# EAGLE design AugmentedStethoscope_v4 (EAGLE 8.6.3)
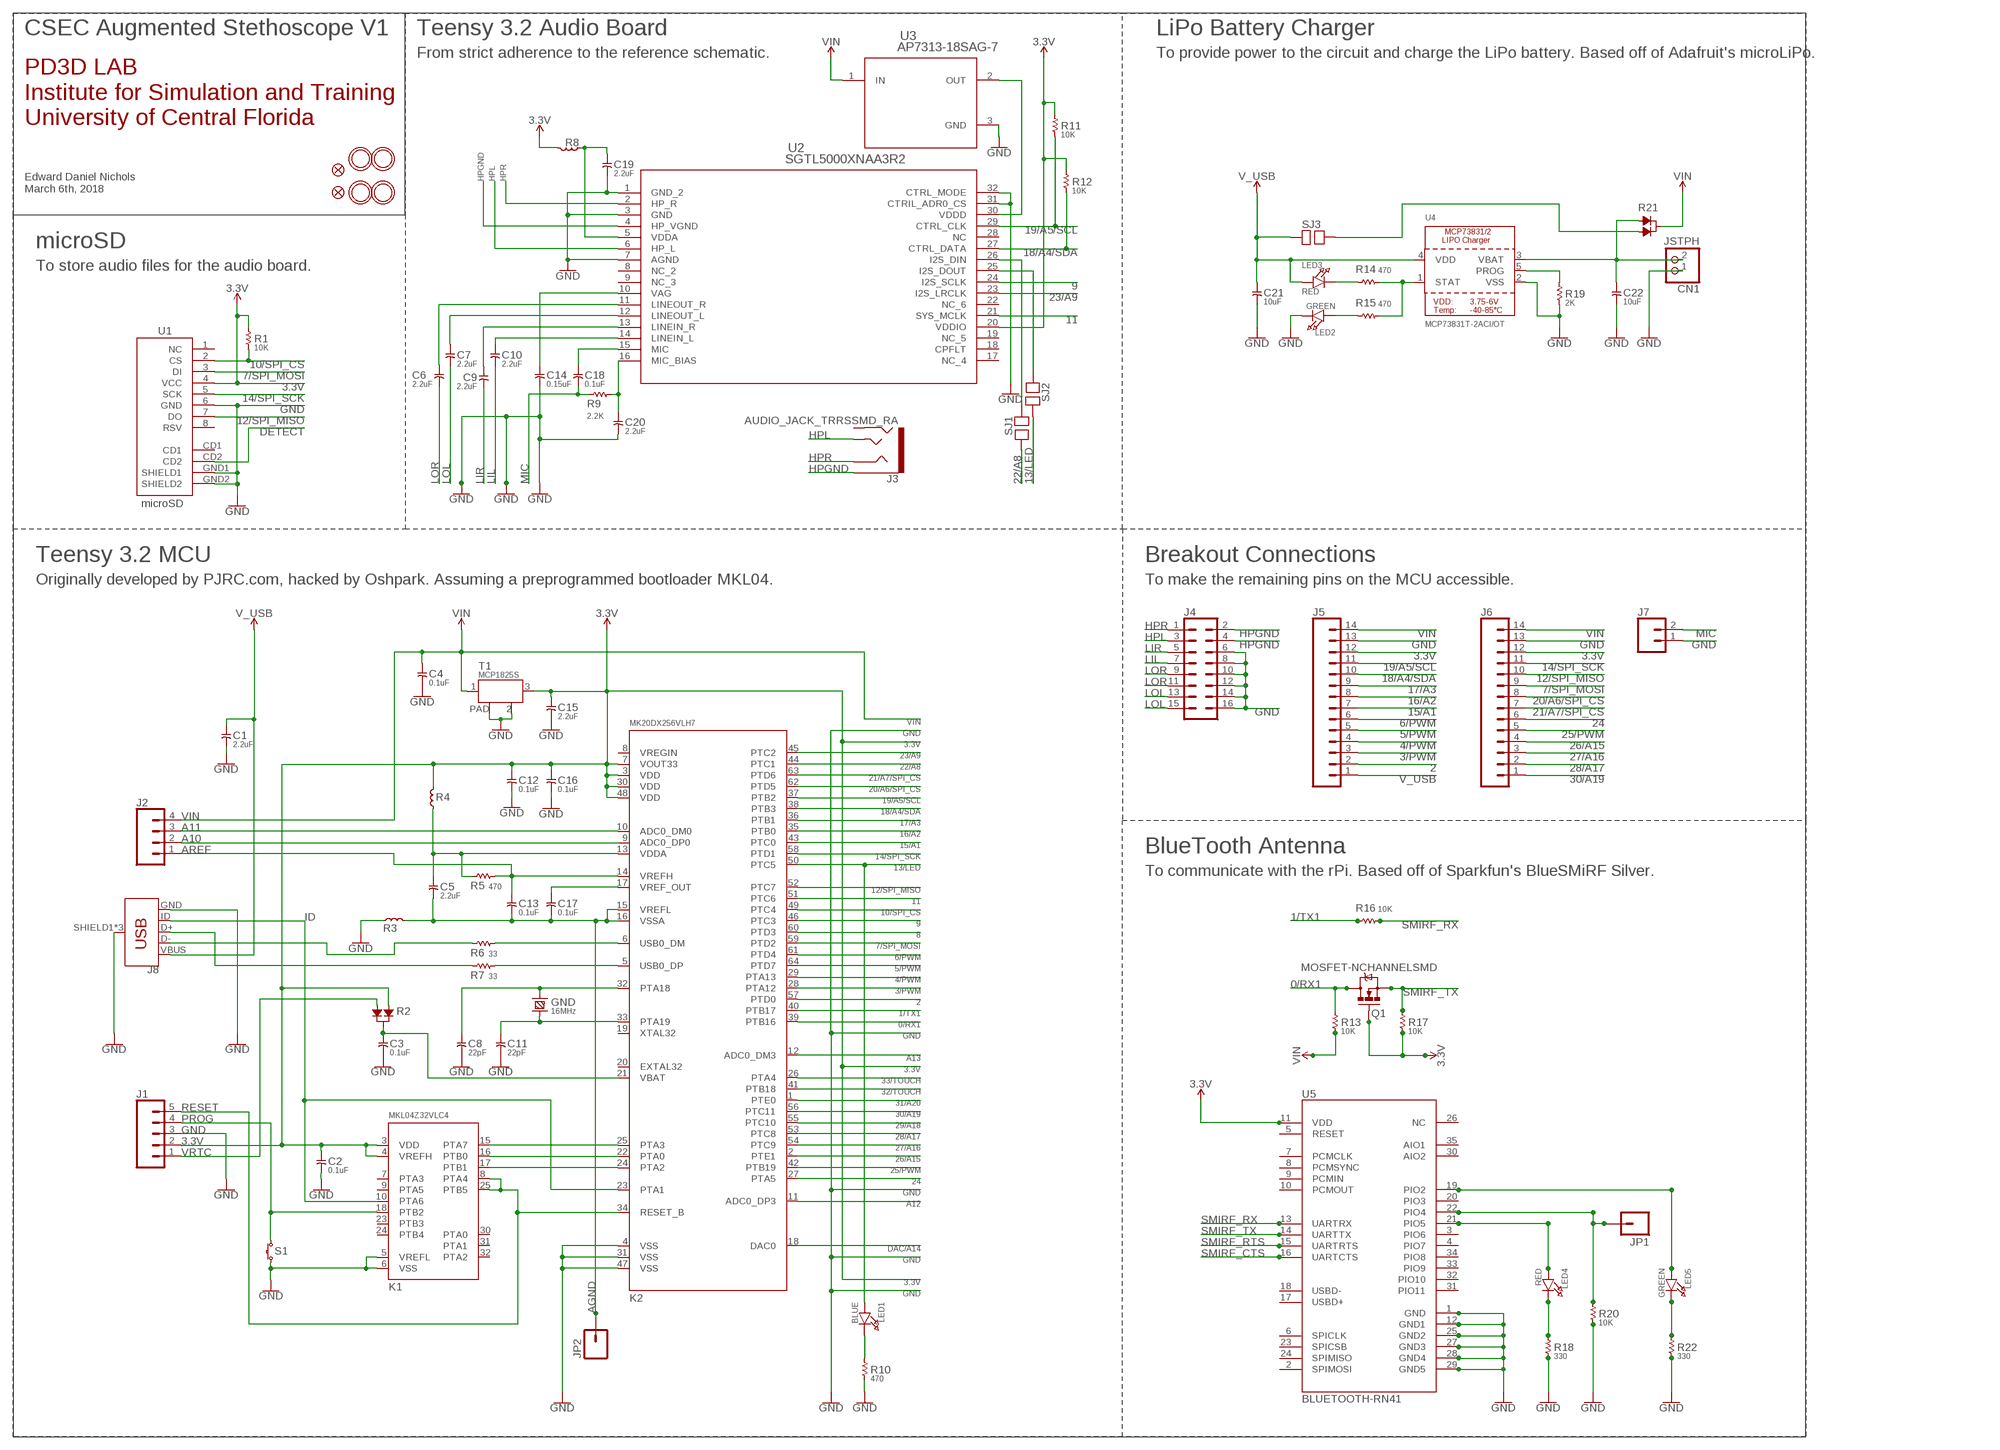
[diagram p0: schematic, sheet 1]

## Parts
C1  2.2uF  CAPACITOR-2.2UF  [C0805]
C2  0.1uF  CAPACITOR-0.1UF  [C0603]
C3  0.1uF  CAPACITOR-0.1UF  [C0603]
C4  0.1uF  CAPACITOR-0.1UF  [C0603]
C5  2.2uF  CAPACITOR-2.2UF  [C0805]
C6  2.2uF  CAPACITOR-2.2UF  [C0805]
C7  2.2uF  CAPACITOR-2.2UF  [C0805]
C8  22pF  CAPACITOR-22PF  [C0603]
C9  2.2uF  CAPACITOR-2.2UF  [C0805]
C10  2.2uF  CAPACITOR-2.2UF  [C0805]
C11  22pF  CAPACITOR-22PF  [C0603]
C12  0.1uF  CAPACITOR-0.1UF  [C0603]
C13  0.1uF  CAPACITOR-0.1UF  [C0603]
C14  0.15uF  CAPACITOR-2.2UF  [C0805]
C15  2.2uF  CAPACITOR-2.2UF  [C0805]
C16  0.1uF  CAPACITOR-0.1UF  [C0603]
C17  0.1uF  CAPACITOR-0.1UF  [C0603]
C18  0.1uF  CAPACITOR-2.2UF  [C0805]
C19  2.2uF  CAPACITOR-2.2UF  [C0805]
C20  2.2uF  CAPACITOR-2.2UF  [C0805]
C21  10uF  CAPACITOR-0.1UF  [C0603]
C22  10uF  CAPACITOR-0.1UF  [C0603]
CN1  JSTPH  JST_2PIN  [JSTPH2]
FID2  FIDUCIAL""  [FIDUCIAL_1MM]
FID3  FIDUCIAL""  [FIDUCIAL_1MM]
GND  16MHz  CRYSTAL-HC49US  [HC49US]
J1  CONN_05  [1X05]
J2  CONN_04  [1X04]
J3  AUDIO_JACK_TRRSSMD_RA  [AUDIO_JACK_3.5MM_TRRS_SMD_RA]
J4  CONN_08X2  [2X8]
J5  CONN_14  [1X14]
J6  CONN_14  [1X14]
J7  CONN_02  [1X02]
J8  USB_MICRO-B_FEMALE-SMT  [USB-B-MICRO-SMD]
JP1  M01SMDNS  [1X01NS]
JP2  M01SMDNS  [1X01NS]
K1  MKL04Z32VLC4  [LQFP32-08]
K2  MK20DX256VLH7  [LQFP64-05]
LED1  BLUE  LED0805  [CHIPLED_0805]
LED2  GREEN  LED0805  [CHIPLED_0805]
LED3  RED  LED0805  [CHIPLED_0805]
LED4  RED  LED0805  [CHIPLED_0805]
LED5  GREEN  LED0805  [CHIPLED_0805]
Q1  MOSFET-NCHANNELSMD  [SOT23-3]
R1  10K  RESISTOR-470R  [R0603]
R2  DIODE_DUAL  [SOT-23]
R3  FERRITE  [L0603]
R4  FERRITE  [L0603]
R5  470  RESISTOR-470R  [R0603]
R6  33  RESISTOR-33R  [R0603]
R7  33  RESISTOR-33R  [R0603]
R8  FERRITE  [L0603]
R9  2.2K  RESISTOR-470R  [R0603]
R10  470  RESISTOR-470R  [R0603]
R11  10K  RESISTOR-470R  [R0603]
R12  10K  RESISTOR-470R  [R0603]
R13  10K  RESISTOR-470R  [R0603]
R14  470  RESISTOR-33R  [R0603]
R15  470  RESISTOR-33R  [R0603]
R16  10K  RESISTOR-33R  [R0603]
R17  10K  RESISTOR-470R  [R0603]
R18  330  RESISTOR-470R  [R0603]
R19  2K  RESISTOR-470R  [R0603]
R20  10K  RESISTOR-470R  [R0603]
R21  DIODE_DUAL  [SOT-23]
R22  330  RESISTOR-470R  [R0603]
S1  TACT_SWITCH  [ALPS_SKHH]
SJ1  SOLDERJUMPER  [SOLDERJUMPER]
SJ2  SOLDERJUMPER  [SOLDERJUMPER]
SJ3  SOLDERJUMPER  [SOLDERJUMPER]
T1  MCP1825S  LDO  [SOT-223]
U1  microSD  USD-SOCKETSMD  [MICRO-SD-SOCKET-PP]
U2  SGTL5000XNAA3R2  [QFN32]
U3  AP7313-18SAG-7  [SOT-23]
U4  MCP73831T-2ACI/OT  MCP73831/2  [SOT23-5]
U5  BLUETOOTH-RN41  BLUETOOTH-RN41"  [RN41]
U$1  MOUNTINGHOLE2.5  [MOUNTINGHOLE_2.5_PLATED]
U$15  MOUNTINGHOLE2.5  [MOUNTINGHOLE_2.5_PLATED]
U$17  MOUNTINGHOLE2.5  [MOUNTINGHOLE_2.5_PLATED]
U$18  MOUNTINGHOLE2.5  [MOUNTINGHOLE_2.5_PLATED]

## Nets
0/RX1: K2.39(PTB16) Q1.3(D) R13.2
1/TX1: K2.40(PTB17) R16.1
2: J5.2 K2.57(PTD0)
3.3V [power]: C2.1 C12.1 C15.1 C16.1 J1.2 J5.12 J6.12 K1.3(VDD) K1.4(VREFH) K2.3(VDD) K2.7(VOUT33) K2.30(VDD) K2.48(VDD) Q1.1(G) R1.2 R2.1 R4.2 R8.2 R11.2 R12.2 R17.1 T1.3(OUT) U1.4(VCC) U2.20(VDDIO) U5.11(VDD)
3/PWM: J5.3 K2.28(PTA12)
4/PWM: J5.4 K2.29(PTA13)
5/PWM: J5.5 K2.64(PTD7)
6/PWM: J5.6 K2.61(PTD4)
7/SPI_MOSI: J6.9 K2.59(PTD2) U1.3(DI)
8: K2.60(PTD3)
9: K2.46(PTC3) U2.24(I2S_SCLK)
10/SPI_CS: K2.49(PTC4) R1.1 U1.2(CS)
11: K2.51(PTC6) U2.21(SYS_MCLK)
12/SPI_MISO: J6.10 K2.52(PTC7) U1.7(DO)
13/LED: K2.50(PTC5) LED1.A SJ2.2
14/SPI_SCK: J6.11 K2.58(PTD1) U1.5(SCK)
15/A1: J5.7 K2.43(PTC0)
16/A2: J5.8 K2.35(PTB0)
17/A3: J5.9 K2.36(PTB1)
18/A4/SDA: J5.10 K2.38(PTB3) R12.1 U2.27(CTRL_DATA)
19/A5/SCL: J5.11 K2.37(PTB2) R11.1 U2.29(CTRL_CLK)
20/A6/SPI_CS: J6.8 K2.62(PTD5)
21/A7/SPI_CS: J6.7 K2.63(PTD6)
22/A8: K2.44(PTC1) SJ1.2
23/A9: K2.45(PTC2) U2.23(I2S_LRCLK)
24: J6.6 K2.27(PTA5)
25/PWM: J6.5 K2.42(PTB19)
26/A15: J6.4 K2.2(PTE1)
27/A16: J6.3 K2.54(PTC9)
28/A17: J6.2 K2.53(PTC8)
29/A18: K2.55(PTC10)
30/A19: J6.1 K2.56(PTC11)
31/A20: K2.1(PTE0)
32/TOUCH: K2.41(PTB18)
33/TOUCH: K2.26(PTA4)
A10: J2.2 K2.9(ADC0_DP0)
A11: J2.3 K2.10(ADC0_DM0)
A12: K2.11(ADC0_DP3)
A13: K2.12(ADC0_DM3)
AGND: C5.2 C13.2 C17.2 JP2.1 K2.15(VREFL) K2.16(VSSA) R3.2
AREF: C13.1 J2.1 K2.14(VREFH) R5.2
D3: LED4.C R18.2
D4: LED5.C R22.2
D+: J8.D+ R7.1
D-: J8.D- R6.1
DAC/A14: K2.18(DAC0)
DETECT: U1.CD2
GND [power]: C1.2 C2.2 C3.2 C4.2 C8.2 C11.2 C12.2 C14.2 C15.2 C16.2 C19.2 C20.2 C21.2 C22.2 CN1.1 J1.3 J4.6 J4.8 J4.10 J4.12 J4.14 J4.16 J5.13 J6.13 J7.1 J8.GND J8.SHIELD1(SHIELD) J8.SHIELD2(SHIELD) J8.SHIELD3(SHIELD) K1.5(VREFL) K1.6(VSS) K2.4(VSS) K2.31(VSS) K2.47(VSS) LED2.C R3.1 R10.1 R18.1 R19.1 R20.1 R22.1 S1.3 S1.4 T1.2(GND) T1.PAD U1.6(GND) U1.GND1(SHIELD1) U1.GND2(SHIELD2) U2.1(GND_2) U2.3(GND) U2.7(AGND) U2.31(CTRIL_ADR0_CS) U2.32(CTRL_MODE) U3.3(GND) U4.2(VSS) U5.1(GND) U5.12(GND1) U5.25(GND2) U5.27(GND3) U5.28(GND4) U5.29(GND5)
HPGND: J3.EARTH J4.2 J4.4 U2.4(HP_VGND)
HPL: J3.TIP J4.3 U2.6(HP_L)
HPR: J3.RING1 J4.1 U2.2(HP_R)
ID: J8.ID K1.10(PTA6) K2.23(PTA1)
LIL: C10.2 J4.7
LIL_ISO: C10.1 U2.14(LINEIN_L)
LIR: C9.2 J4.5
LIR_ISO: C9.1 U2.13(LINEIN_R)
LOL: C7.2 J4.13 J4.15
LOL_ISO: C7.1 U2.12(LINEOUT_L)
LOR: C6.2 J4.9 J4.11
LOR_ISO: C6.1 U2.11(LINEOUT_R)
MIC: C18.2 J7.2 R9.1
MIC_BIAS: C20.1 R9.2 U2.16(MIC_BIAS)
N$1: C22.1 CN1.2 R21.1 U4.3(VBAT)
N$2: K1.16(PTB0) K2.22(PTA0)
N$3: K1.17(PTB1) K2.24(PTA2)
N$4: C14.1 U2.10(VAG)
N$5: C8.1 GND.1 K2.32(PTA18)
N$6: C11.1 GND.2 K2.33(PTA19)
N$9: SJ1.1 U2.26(I2S_DIN)
N$10: K2.5(USB0_DP) R7.2
N$11: C17.1 K2.17(VREF_OUT)
N$12: U2.30(VDDD) U3.2(OUT)
N$13: SJ2.1 U2.25(I2S_DOUT)
N$14: K2.6(USB0_DM) R6.2
N$15: C5.1 K2.13(VDDA) R4.1 R5.1
N$18: R21.2 SJ3.2
N$52: LED1.C R10.2
N$68: C3.1 K2.21(VBAT) R2.3
N$70: K1.15(PTA7) K2.25(PTA3)
N$71: LED3.C R14.1
N$72: R14.2 R15.2 U4.1(STAT)
N$73: LED4.A U5.21(PIO5)
N$74: LED5.A U5.19(PIO2)
N$75: R19.2 U4.5(PROG)
N$76: LED2.A R15.1
N$79: C19.1 R8.1 U2.5(VDDA)
N$80: C18.1 U2.15(MIC)
PIO4: JP1.1 R20.2 U5.22(PIO4)
PROG: J1.4 K1.18(PTB2) S1.1 S1.2
RESET: J1.5 K1.8(PTA4) K1.25(PTB5) K2.34(RESET_B)
SMIRF_CTS: U5.16(UARTCTS)
SMIRF_RTS: U5.15(UARTRTS)
SMIRF_RX: R16.2 U5.13(UARTRX)
SMIRF_TX: Q1.2(S) R17.2 U5.14(UARTTX)
V_USB [power]: C1.1 C21.1 J5.1 J8.VBUS LED3.A SJ3.1 U4.4(VDD)
VIN [power]: C4.1 J2.4 J5.14 J6.14 R13.1 R21.3 T1.1(IN) U3.1(IN)
VRTC: J1.1 R2.2
Unconnected: J3.RING2 K1.7(PTA3) K1.9(PTA5) K1.23(PTB3) K1.24(PTB4) K1.30(PTA0) K1.31(PTA1) K1.32(PTA2) K2.8(VREGIN) K2.19(XTAL32) K2.20(EXTAL32) U1.1(NC) U1.8(RSV) U1.CD1 U2.8(NC_2) U2.9(NC_3) U2.17(NC_4) U2.18(CPFLT) U2.19(NC_5) U2.22(NC_6) U2.28(NC) U5.2(SPIMOSI) U5.3(PIO6) U5.4(PIO7) U5.5(RESET) U5.6(SPICLK) U5.7(PCMCLK) U5.8(PCMSYNC) U5.9(PCMIN) U5.10(PCMOUT) U5.17(USBD+) U5.18(USBD-) U5.20(PIO3) U5.23(SPICSB) U5.24(SPIMISO) U5.26(NC) U5.30(AIO2) U5.31(PIO11) U5.32(PIO10) U5.33(PIO9) U5.34(PIO8) U5.35(AIO1)

## Notes on the sheet
- CSEC Augmented Stethoscope V1 | Teensy 3.2 Audio Board | LiPo Battery Charger
- From strict adherence to the reference schematic. | To provide power to the circuit and charge the LiPo battery. Based off of Adafruit's microLiPo.
- PD3D LAB
  Institute for Simulation and Training
  University of Central Florida
- Edward Daniel Nichols
  March 6th, 2018
- microSD
- To store audio files for the audio board.
- Teensy 3.2 MCU | Breakout Connections
- Originally developed by PJRC.com, hacked by Oshpark. Assuming a preprogrammed bootloader MKL04. | To make the remaining pins on the MCU accessible.
- BlueTooth Antenna
- To communicate with the rPi. Based off of Sparkfun's BlueSMiRF Silver.

## Library data of the parts
C1 C5-C7 C9 C10 C15 C19 C20 = t32_ref:CAPACITOR-2.2UF; DESC: 2.2uF / 25 VDC / X7R; MF: Taiyo Yuden; MPN: TMK212B7225KG-TR; OC_MOUSER: 963-TMK212B7225KG-TR; PACKAGE: 0805; TYPE: Capacitor
C2-C4 C12 C13 C16 C17 = t32_ref:CAPACITOR-0.1UF; DESC: 0.1uF / 16VDC / X7R; MF: Murata Electronics; MPN: GRM188R71C104KA01D; OC_MOUSER: 81-GRM39X104K16; PACKAGE: 0603; TYPE: Capacitor
C8 C11 = t32_ref:CAPACITOR-22PF; DESC: 22pF / 50VDC / C0G (NP0); MF: Vishay / Vitramon; MPN: VJ0603A220JXACW1BC; OC_MOUSER: 77-VJ0603A220JXACBC; PACKAGE: 0603; TYPE: Capacitor
C14 C18 = t32_ref:CAPACITOR-2.2UF; DESC: 2.2uF / 25 VDC / X7R; MF: Taiyo Yuden; MPN: TMK212B7225KG-TR; OC_MOUSER: 963-TMK212B7225KG-TR; PACKAGE: 0805; TYPE: Capacitor; VALUE: 2.2uF
C21 C22 = t32_ref:CAPACITOR-0.1UF; DESC: 0.1uF / 16VDC / X7R; MF: Murata Electronics; MPN: GRM188R71C104KA01D; OC_MOUSER: 81-GRM39X104K16; PACKAGE: 0603; TYPE: Capacitor; VALUE: 0.1uF
CN1 = microbuilder:JST_2PIN: JST 2-Pin Right-Angle Connector PH-Series - 4UConnector: 17311 SH-Series - 4UConnector: 07278
FID2 FID3 = microbuilder:FIDUCIAL: Fiducial Alignment Points Various fiducial points for machine vision alignment.; BOM: EXCLUDE
GND = t32_ref:CRYSTAL-; DESC: 16MHz / 18pF / 10ppm; MF: ABRACON; MPN: ABL-16.000MHz-B1U; OC_MOUSER: 815-ABL-16-B1U; PACKAGE: HC-49US; TYPE: Crystal
J1 = SparkFun-Connectors:CONN_05: Multi connection point. Often used as Generic Header-pin footprint for 0.1 inch spaced/style header connections On any of the 0.1 inch spaced packages, you can populate with these: Break Away Headers - Straight <https://www.sparkfun.com/products/116> (PRT-00116) Break Away Male Headers - Right Angle <https://www.sparkfun.com/products/553> (PRT-00553) Female Headers <https://www.sparkfun.com/products/115> (PRT-00115) Break Away Headers - Machine Pin <https://www.sparkfun.com/products/117> (PRT-00117) Break Away Female Headers - Swiss Machine Pin <https://www.sparkfun.com/products/743> (PRT-00743) For SCREWTERMINALS and SPRING TERMINALS visit here: Screw Terimnals on SparkFun.com <https://www.sparkfun.com/search/results?term=Screw+Terminals> (5mm/3.5mm/2.54mm spacing) This device is also useful as a general connection point to wire up your design to another part of your project. Our various solder wires solder well into these plated through hole pads. Hook-Up Wire - Assortment (Stranded, 22 AWG) <https://www.sparkfun.com/products/11375> (PRT-11375) Hook-Up Wire - Assortment (Solid Core, 22 AWG) <https://www.sparkfun.com/products/11367> (PRT-11367) View the entire wire category on our website here <https://www.sparkfun.com/categories/141> Special notes: Molex polarized connector foot print use with SKU : PRT-08231 with associated crimp pins and housings. 1MM SMD Version SKU: PRT-10208
J2 = SparkFun-Connectors:CONN_04: Multi connection point. Often used as Generic Header-pin footprint for 0.1 inch spaced/style header connections On any of the 0.1 inch spaced packages, you can populate with these: Break Away Headers - Straight <https://www.sparkfun.com/products/116> (PRT-00116) Break Away Male Headers - Right Angle <https://www.sparkfun.com/products/553> (PRT-00553) Female Headers <https://www.sparkfun.com/products/115> (PRT-00115) Break Away Headers - Machine Pin <https://www.sparkfun.com/products/117> (PRT-00117) Break Away Female Headers - Swiss Machine Pin <https://www.sparkfun.com/products/743> (PRT-00743) For SCREWTERMINALS and SPRING TERMINALS visit here: Screw Terimnals on SparkFun.com <https://www.sparkfun.com/search/results?term=Screw+Terminals> (5mm/3.5mm/2.54mm spacing) This device is also useful as a general connection point to wire up your design to another part of your project. Our various solder wires solder well into these plated through hole pads. Hook-Up Wire - Assortment (Stranded, 22 AWG) <https://www.sparkfun.com/products/11375> (PRT-11375) Hook-Up Wire - Assortment (Solid Core, 22 AWG) <https://www.sparkfun.com/products/11367> (PRT-11367) View the entire wire category on our website here <https://www.sparkfun.com/categories/141> Special notes: Molex polarized connector foot print use with SKU : PRT-08231 with associated crimp pins and housings. 1MM SMD Version SKU: PRT-10208; PROD_ID: CONN-09696
J3 = SparkFun-Connectors:AUDIO_JACK_TRRS: Audio Jack - 3.5mm TRRS (SMD) This is a 3.5mm TRRS SMD audio jack. TRRS connectors are the audio-style connectors that you see on some phones, MP3 players and development boards. TRRS stands for “tip, ring, ring, sleeve,” which reflects that this has three conductors and a ground. SparkFun Products: Audio Jack <https://www.sparkfun.com/products/12639> mbed Starter Kit <https://www.sparkfun.com/products/12968> SparkFun TRRS 3.5mm Jack Breakout <https://www.sparkfun.com/products/11570>; PROD_ID: CONN-10676; SF_ID: PRT-12639
J4 = SparkFun-Connectors:CONN_08X2: Multi connection point. Often used as Generic Header-pin footprint for 0.1 inch spaced/style header connections You can populate with any combo of single row headers, but if you'd like an exact match, check this: Header - 2x8 (Male, 0.1") <https://www.sparkfun.com/products/13156> (PRT-13156) On any of the 0.1 inch spaced packages, you can populate with these: Break Away Headers - Straight <https://www.sparkfun.com/products/116> (PRT-00116) Break Away Male Headers - Right Angle <https://www.sparkfun.com/products/553> (PRT-00553) Female Headers <https://www.sparkfun.com/products/115> (PRT-00115) Break Away Headers - Machine Pin <https://www.sparkfun.com/products/117> (PRT-00117) Break Away Female Headers - Swiss Machine Pin <https://www.sparkfun.com/products/743> (PRT-00743)
J5 J6 = SparkFun-Connectors:CONN_14: Multi connection point. Often used as Generic Header-pin footprint for 0.1 inch spaced/style header connections On any of the 0.1 inch spaced packages, you can populate with these: Break Away Headers - Straight <https://www.sparkfun.com/products/116> (PRT-00116) Break Away Male Headers - Right Angle <https://www.sparkfun.com/products/553> (PRT-00553) Female Headers <https://www.sparkfun.com/products/115> (PRT-00115) Break Away Headers - Machine Pin <https://www.sparkfun.com/products/117> (PRT-00117) Break Away Female Headers - Swiss Machine Pin <https://www.sparkfun.com/products/743> (PRT-00743) For SCREWTERMINALS and SPRING TERMINALS visit here: Screw Terimnals on SparkFun.com <https://www.sparkfun.com/search/results?term=Screw+Terminals> (5mm/3.5mm/2.54mm spacing) This device is also useful as a general connection point to wire up your design to another part of your project. Our various solder wires solder well into these plated through hole pads. Hook-Up Wire - Assortment (Stranded, 22 AWG) <https://www.sparkfun.com/products/11375> (PRT-11375) Hook-Up Wire - Assortment (Solid Core, 22 AWG) <https://www.sparkfun.com/products/11367> (PRT-11367) View the entire wire category on our website here <https://www.sparkfun.com/categories/141> Special notes: Molex polarized connector foot print use with SKU : PRT-08231 with associated crimp pins and housings. 1MM SMD Version SKU: PRT-10208 NOTES ON THE VARIANTS LOCK and LOCK_LONGPADS... This footprint was designed to help hold the alignment of a through-hole component (i.e. 6-pin header) while soldering it into place. You may notice that each hole has been shifted either up or down by 0.005 of an inch from it's more standard position (which is a perfectly straight line). This slight alteration caused the pins (the squares in the middle) to touch the edges of the holes. Because they are alternating, it causes a "brace" to hold the component in place. 0.005 has proven to be the perfect amount of "off-center" position when using our standard breakaway headers. Although looks a little odd when you look at the bare footprint, once you have a header in there, the alteration is very hard to notice. Also,if you push a header all the way into place, it is covered up entirely on the bottom side.
J7 = SparkFun-Connectors:CONN_02: Multi connection point. Often used as Generic Header-pin footprint for 0.1 inch spaced/style header connections On any of the 0.1 inch spaced packages, you can populate with these: Break Away Headers - Straight <https://www.sparkfun.com/products/116> (PRT-00116) Break Away Male Headers - Right Angle <https://www.sparkfun.com/products/553> (PRT-00553) Female Headers <https://www.sparkfun.com/products/115> (PRT-00115) Break Away Headers - Machine Pin <https://www.sparkfun.com/products/117> (PRT-00117) Break Away Female Headers - Swiss Machine Pin <https://www.sparkfun.com/products/743> (PRT-00743) For SCREWTERMINALS and SPRING TERMINALS visit here: Screw Terimnals on SparkFun.com <https://www.sparkfun.com/search/results?term=Screw+Terminals> (5mm/3.5mm/2.54mm spacing) This device is also useful as a general connection point to wire up your design to another part of your project. Our various solder wires solder well into these plated through hole pads. Hook-Up Wire - Assortment (Stranded, 22 AWG) <https://www.sparkfun.com/products/11375> (PRT-11375) Hook-Up Wire - Assortment (Solid Core, 22 AWG) <https://www.sparkfun.com/products/11367> (PRT-11367) View the entire wire category on our website here <https://www.sparkfun.com/categories/141> Special notes: Molex polarized connector foot print use with: PRT-08233 with associated crimp pins and housings. 2.54_SCREWTERM for use with PRT-10571. 3.5mm Screw Terminal footprints for PRT-08084 5mm Screw Terminal footprints for use with PRT-08432
J8 = SparkFun-Connectors:USB_MICRO-B: USB Type Micro-B Connector Male/female and PTH/SMT variants SparkFun Products: SparkFun microB USB Breakout <https://www.sparkfun.com/products/12035> SparkFun USB microB Plug Breakout <https://www.sparkfun.com/products/10031> SparkFun ESP8266 Thing <https://www.sparkfun.com/products/13231>; PROD_ID: CONN-11752
JP1 JP2 = SparkFun:M01: Header 1 Standard 1-pin 0.1" header. Use with straight break away headers (SKU : PRT-00116), right angle break away headers (PRT-00553), swiss pins (PRT-00743), machine pins (PRT-00117), and female headers (PRT-00115).
K1 = t32_ref:MKL04Z32VLC4; DESC: MKL04Z32VLC4 (preprogrammed); MF: PJRC; MPN: IC_MKL04Z32_TQFP32; PACKAGE: LQFP-32; TYPE: Microcontroller
K2 = t32_ref:MK20DX256VLH7; DESC: MK20DX256VLH7; MF: NXP; MPN: MK20DX256VLH7; OC_MOUSER: 841-MK20DX256VLH7; PACKAGE: LQFP-64; TYPE: Microcontroller
LED1-LED5 = microbuilder:LED: LED 0603 - 0603 Surface Mount Package 2mA: Green LED - Low Power (3.9mcd, 2ma, 1.7Vf) - Digikey: 475-2709-2-ND Orange LED - Low Power (9.8mcd, 2ma, 1.8Vf) - Digikey: 475-1194-2-ND Red LED - Low Power (5mcd, 2ma, 1.8Vf) - Digikey: 475-1195-2-ND Yellow LED - Low Power (7mcd, 2ma, 1.8Vf) - Digikey: 475-1196-2-ND 5mA: Blue LED - Low Power (17mcd, 5ma, 2.9Vf) - Digikey: LNJ937W8CRACT-ND 0805 - 0805 Surface Mount Package 2mA: Red LED (8.8mcd, 2mA, 1.8Vf, Clear) - Low Power [Digikey: 475-2510-1-ND] Green LED (5mcd, 2mA, 1.8Vf, Clear) - Low Power [Digikey: 475-2730-1-ND] Yellow LED (11.3mcd, 2mA, 1.8Vf, Clear) - Low Power [Digikey: 475-2555-1-ND] 20mA: Red LED (104mcd, 20mA, Diffused) - LS R976 [Digikey: 475-1278-6-ND] Red LED (12mcd, 20mA, 2.0Vf, Clear) - APT2012EC [Digikey: 754-1128-1-ND] Green LED (15mcd, 20mA, 2.2Vf, Clear) - APT2012GC [Digikey: 754-1131-1-ND] Orange LED (160mcd, 20mA, 2.1Vf, Clear) - APT2012SECK [Digikey: 754-1130-1-ND] 1206 - 1206 Surface Mount Package Green LED (26mcd, 20mA, Diffused) - LG N971 [Digikey: 475-1407-6-ND] Red LED (15mcd, 20mA, Diffused) - LH N974 [Digikey: 475-1416-6-ND] Cree - Cree High-Power Surface Mount LEDs XPEBWT-L1-0000-00D50 - White 111lm 350mA 2.9Vf 6200K 110° XTEAWT-00-0000-00000LEE3 - White 114lm 350mA 2.85Vf 5000K 115°
Q1 = SparkFun:MOSFET-NCHANNEL
R1 R5 R9-R13 R17-R20 R22 = t32_ref:RESISTOR-470R; DESC: 470R / 1 % / 0.1 W; MF: Vishay; MPN: CRCW0603470RFKEA; OC_MOUSER: 71-CRCW0603-470-E3; PACKAGE: 0603; TYPE: Resistor; VALUE: 470R
R2 R21 = t32_ref:DIODE_DUAL; DESC: Dual Schottky, common cat; MF: NXP Semiconductors; MPN: BAT54C,215; OC_MOUSER: 771-BAT54C-T/R; PACKAGE: SOT-23; TYPE: Diode
R3 R4 R8 = t32_ref:FERRITE; DESC: 600R / 100MHz; MF: Murata Electronics; MPN: BLM18AG601SN1D; OC_MOUSER: 81-BLM11A601S; PACKAGE: 0603; TYPE: Ferrite
R6 R7 R14-R16 = t32_ref:RESISTOR-33R; DESC: 33R / 1% / 0.25 W; MF: Panasonic; MPN: ERJ-PA3F33R0V; OC_MOUSER: 667-ERJ-PA3F33R0V; PACKAGE: 0603; TYPE: Resistor; VALUE: 33R
S1 = t32_ref:TACT_SWITCH; DESC: SPST; MF: ALPS; MPN: SKHHPKA010; OC_MOUSER: 688-SKHHPK; PACKAGE: 6x6x5 MM; TYPE: Tactile switch
SJ1-SJ3 = t32_ref:SOLDERJUMPER
T1 = t32_ref:LDO; DESC: 3.3V 500mA; MF: Microchip Technology; MPN: MCP1825S-3302E/DB; OC_MOUSER: 579-MCP1825S-3302EDB; PACKAGE: SOT-223-3; TYPE: Voltage regulator
U1 = SparkFun:USD-SOCKET: microSD Socket Push-push type uSD socket. Schematic element and footprint production proven. Spark Fun Electronics SKU : PRT-00127. tDoc lines correctly indicate media card edge positions when inserting (unlocked, locked, depressed).
U2 = pd3d_augmentedstethoscope:SGTL5000XNAA3R2: SGTL5000XNAA3R2TR-ND Low Power Stereo Codec with Headphone Amp used on the Teensy 3.1+ Audio Board Datasheet: https://www.nxp.com/docs/en/data-sheet/SGTL5000.pdf (valid as of Feb. 2018) Exported from digikey.ultralibrarian.com under part ID: SGTL5000XNAA3R2TR-ND EDN; MANUFACTURER_PART_NUMBER: SGTL5000XNAA3R2; VENDOR: Freescale
U3 = pd3d_augmentedstethoscope:AP7313-18SAG-7: Voltage Regulator; MANUFACTURER_PART_NUMBER: AP731318SAG7; VENDOR: Diodes Inc
U4 = microbuilder:MCP73831/2: MCP73831/2 LIPO Charger VDD: 3.75 - 6V Temp -40 - 85°C Programmable Charge Rate: 15-500mA NOTE: STAT is a tri-state logic output on the MCP73831 and an open-drain output on the MCP73832. SOT23-5 with 4.2V output and tri-state logic on STAT = MCP73831T-2ACI/OT
U5 = ScratchPad:BLUETOOTH-RN41
U$1 U$15 U$17 U$18 = microbuilder:MOUNTINGHOLE: Mounting Hole For #2 screws (0.086"/2.18mm width, 0.094"/2.4mm hole) use 2.5mm; BOM: EXCLUDE

## Net classes
0 default: width 0.203 mm, drill 0.203 mm, clearance 0.152 mm
1 power: width 0.406 mm, drill 0.203 mm, clearance 0.203 mm

## Board
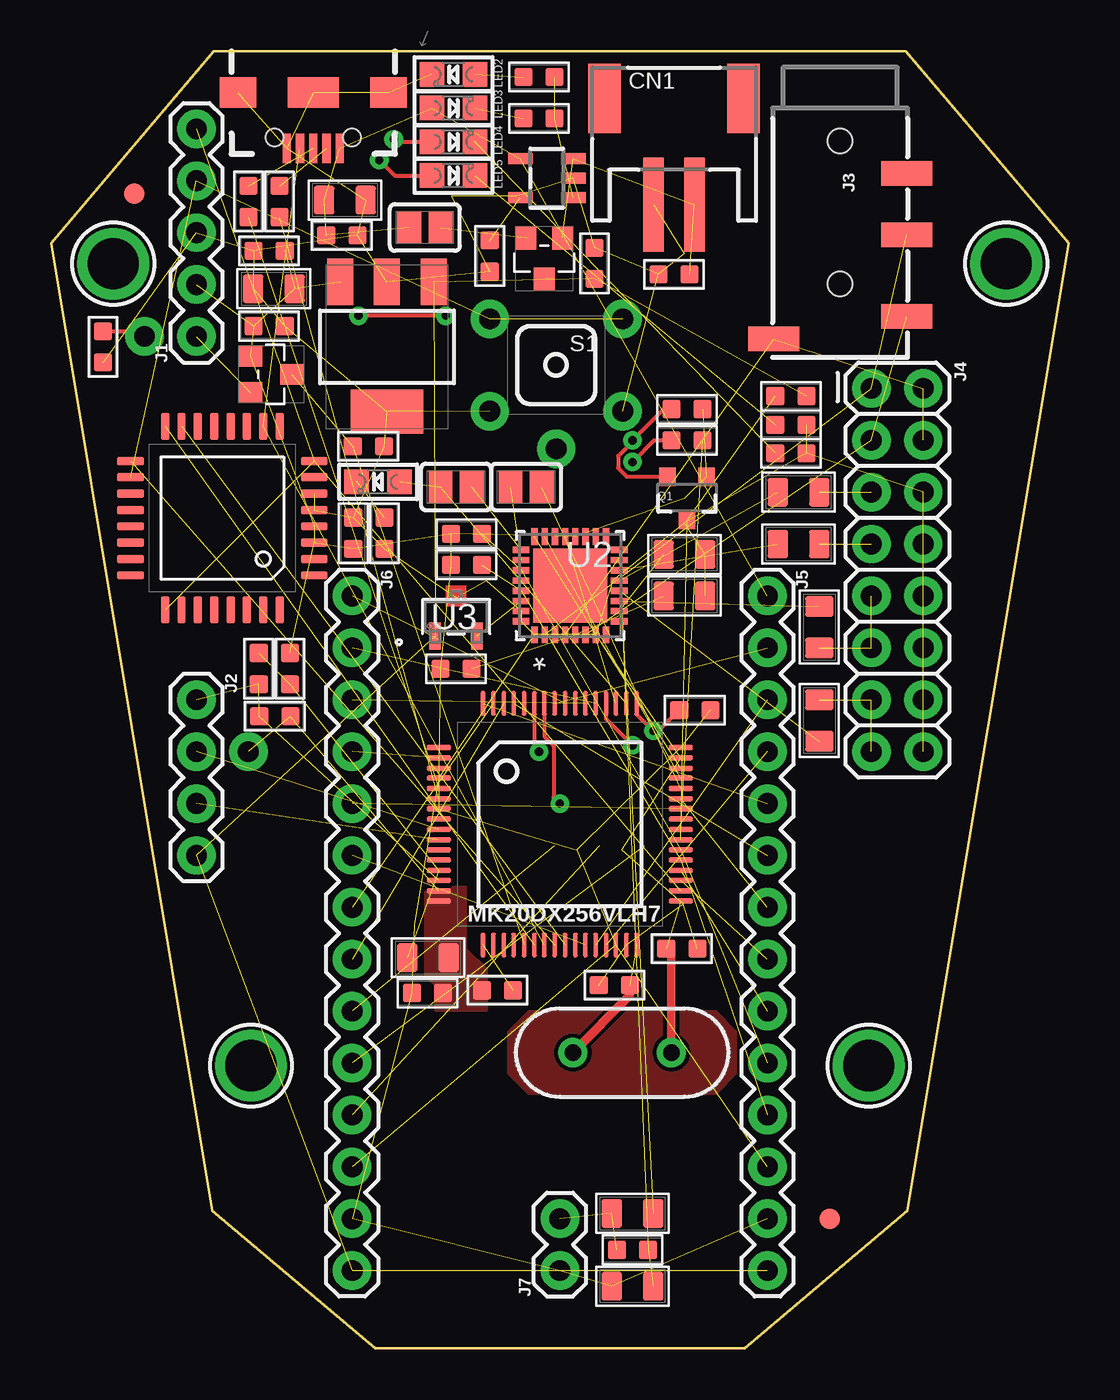
[diagram p1: board, top side]
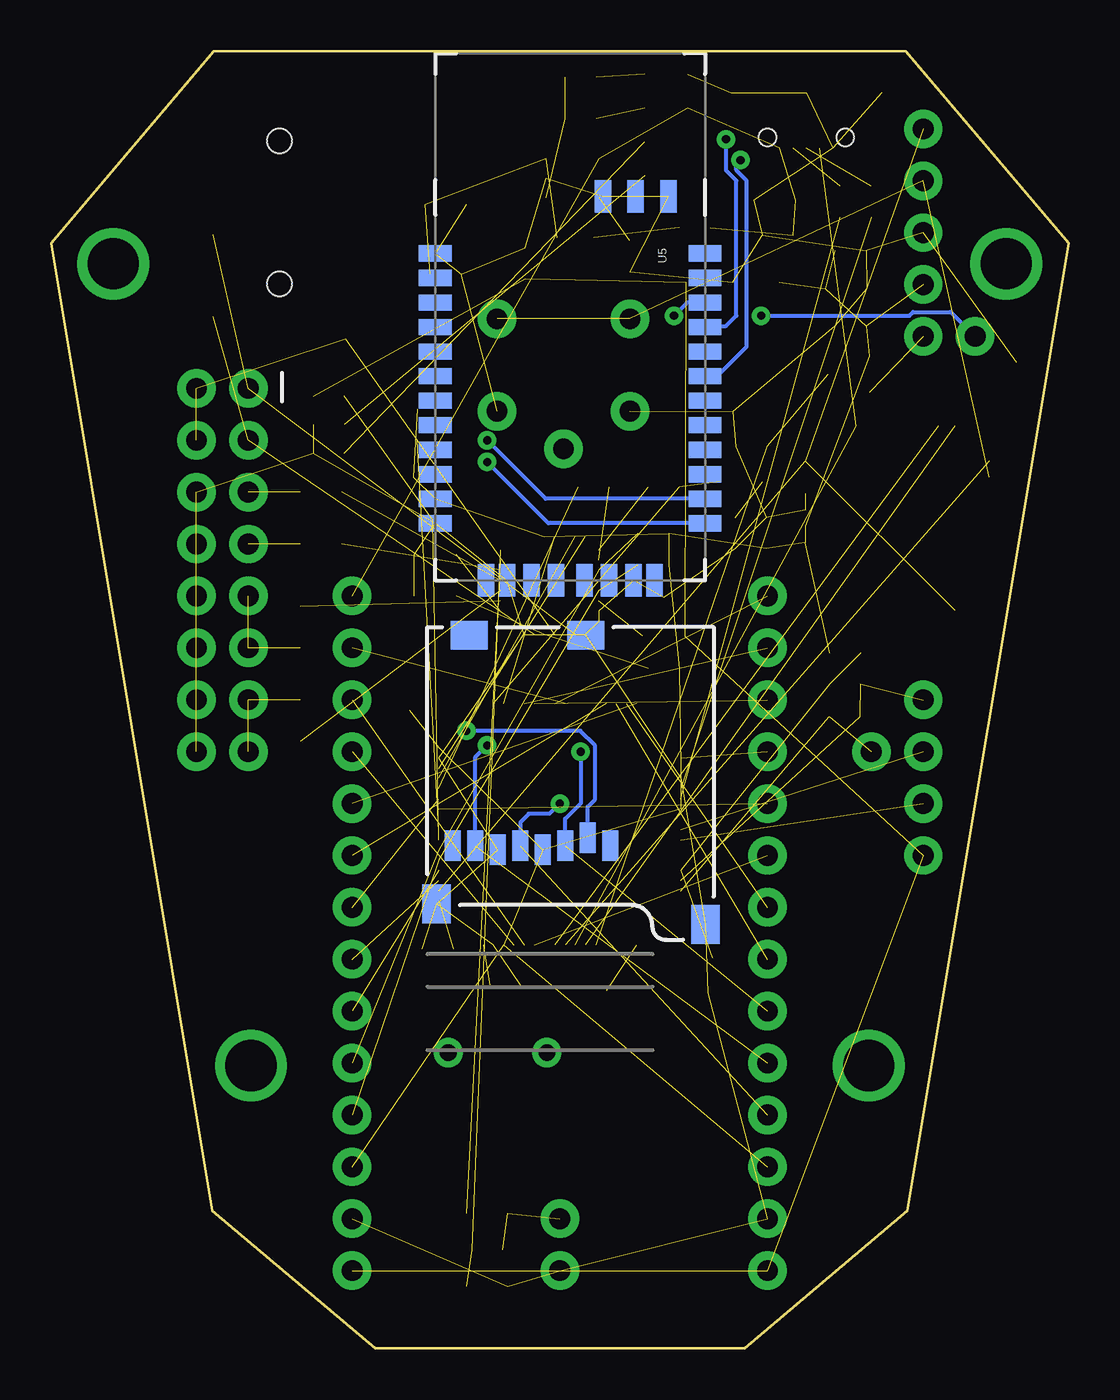
[diagram p2: board, bottom side, seen from below]

Size 49.78 x 63.5 mm. Coordinates in mm from the lower left corner, seen from the top.
Outline: 0,54.11 7.89,6.74 15.85,0 33.93,0 41.89,6.74 49.78,54.11 41.83,63.5 7.96,63.5 0,54.11
Copper layers (1*16): Top 0.035mm / dielectric 1.5mm / Bottom 0.035mm
Design rules "SparkFun *": minimum track width 8mil, minimum drill 20mil, track to track 6mil, track to pad 6mil, pad to pad 6mil, via to via 6mil, smd to smd 6mil, copper to edge 10mil, drill to drill 8mil, minimum pad ring 12mil, minimum via ring 10mil, stop-mask expansion 4mil, vias tented up to drill 25mil, thermal gap 10mil

### Footprints (pad centres in the part's own frame; a part is rotated, then mirrored left to right if it is on the bottom)
C0805 = smd 1.397 x 1.016: 1 0,1.016; 2 0,-1.016
C0603 = smd 0.889 x 0.889: 1 0,0.762; 2 0,-0.762
JSTPH2 = smd 1 x 4.6: 1 -1,-3.7; 2 1,-3.7 | smd 1.6 x 3.4: NC1 -3.4,1.5; NC2 3.4,1.5
FIDUCIAL_1MM = smd 1 x 1: 1 0,0
HC49US = drill 0.813: 1 -2.413,0; 2 2.413,0
1X05 = drill 1.016 pad 1.88: 1 0,0; 2 2.54,0; 3 5.08,0; 4 7.62,0; 5 10.16,0
1X04 = drill 1.016 pad 1.88: 1 0,0; 2 2.54,0; 3 5.08,0; 4 7.62,0
AUDIO_JACK_3.5MM_TRRS_SMD_RA = smd 1.2 x 2.5: EARTH 11.3,-3.25; RING1 6.2,3.25; RING2 3.2,3.25; TIP 10.2,3.25 | hole 1.2: 1.6,0; 8.6,0
2X8 = drill 1.016 pad 1.88: 1 0,0; 2 0,2.54; 3 2.54,0; 4 2.54,2.54; 5 5.08,0; 6 5.08,2.54; 7 7.62,0; 8 7.62,2.54; 9 10.16,0; 10 10.16,2.54; 11 12.7,0; 12 12.7,2.54; 13 15.24,0; 14 15.24,2.54; 15 17.78,0; 16 17.78,2.54
1X14 = drill 1.016 pad 1.88: 1 0,0; 2 2.54,0; 3 5.08,0; 4 7.62,0; 5 10.16,0; 6 12.7,0; 7 15.24,0; 8 17.78,0; 9 20.32,0; 10 22.86,0; 11 25.4,0; 12 27.94,0; 13 30.48,0; 14 33.02,0
1X02 = drill 1.016 pad 1.88: 1 0,0; 2 2.54,0
USB-B-MICRO-SMD = smd 1.45 x 0.4: D+ 2.725,0; D- 2.725,0.65; GND 2.725,-1.3; ID 2.725,-0.65; VBUS 2.725,1.3 | smd 1.5 x 1.8: SHIELD1 0,3.685; SHIELD2 0,-3.685 | smd 1.5 x 2.5: SHIELD3 0,0 | hole 0.85: 2.2,1.9; 2.2,-1.9
1X01NS = drill 1.016 pad 1.88: 1 0,0
LQFP32-08 = smd 1.3 x 0.4: 1 -4.493,2.8; 2 -4.493,2; 3 -4.493,1.2; 4 -4.493,0.4; 5 -4.493,-0.4; 6 -4.493,-1.2; 7 -4.493,-2; 8 -4.493,-2.8; 17 4.493,-2.8; 18 4.493,-2; 19 4.493,-1.2; 20 4.493,-0.4; 21 4.493,0.4; 22 4.493,1.2; 23 4.493,2; 24 4.493,2.8 | smd 0.4 x 1.3: 9 -2.8,-4.493; 10 -2,-4.493; 11 -1.2,-4.493; 12 -0.4,-4.493; 13 0.4,-4.493; 14 1.2,-4.493; 15 2,-4.493; 16 2.8,-4.493; 25 2.8,4.493; 26 2,4.493; 27 1.2,4.493; 28 0.4,4.493; 29 -0.4,4.493; 30 -1.2,4.493; 31 -2,4.493; 32 -2.8,4.493
LQFP64-05 = smd 1.2 x 0.25: 1 -5.915,3.759; 2 -5.915,3.251; 3 -5.915,2.743; 4 -5.915,2.261; 5 -5.915,1.753; 6 -5.915,1.245; 7 -5.915,0.762; 8 -5.915,0.254; 9 -5.915,-0.254; 10 -5.915,-0.762; 11 -5.915,-1.245; 12 -5.915,-1.753; 13 -5.915,-2.261; 14 -5.915,-2.743; 15 -5.915,-3.251; 16 -5.915,-3.759; 33 5.915,-3.759; 34 5.915,-3.251; 35 5.915,-2.743; 36 5.915,-2.261; 37 5.915,-1.753; 38 5.915,-1.245; 39 5.915,-0.762; 40 5.915,-0.254; 41 5.915,0.254; 42 5.915,0.762; 43 5.915,1.245; 44 5.915,1.753; 45 5.915,2.261; 46 5.915,2.743; 47 5.915,3.251; 48 5.915,3.759 | smd 0.25 x 1.2: 17 -3.759,-5.915; 18 -3.251,-5.915; 19 -2.743,-5.915; 20 -2.261,-5.915; 21 -1.753,-5.915; 22 -1.245,-5.915; 23 -0.762,-5.915; 24 -0.254,-5.915; 25 0.254,-5.915; 26 0.762,-5.915; 27 1.245,-5.915; 28 1.753,-5.915; 29 2.261,-5.915; 30 2.743,-5.915; 31 3.251,-5.915; 32 3.759,-5.915; 49 3.759,5.915; 50 3.251,5.915; 51 2.743,5.915; 52 2.261,5.915; 53 1.753,5.915; 54 1.245,5.915; 55 0.762,5.915; 56 0.254,5.915; 57 -0.254,5.915; 58 -0.762,5.915; 59 -1.245,5.915; 60 -1.753,5.915; 61 -2.261,5.915; 62 -2.743,5.915; 63 -3.251,5.915; 64 -3.759,5.915
CHIPLED_0805 = smd 1.2 x 1.2: A 0,-1.05; C 0,1.05
SOT23-3 = smd 0.8 x 0.9: 1 -0.95,-1; 2 0.95,-1; 3 0,1.1
R0603 = smd 0.889 x 0.889: 1 0,0.762; 2 0,-0.762
SOT-23 = smd 1.016 x 1.143: 1 -0.889,-1.016; 2 0.889,-1.016; 3 0,1.016
L0603 = smd 0.889 x 0.889: 1 -0.762,0; 2 0.762,0
ALPS_SKHH = drill 1.016 pad 1.88: 1 -3.251,2.261; 2 3.251,2.261; 3 -3.251,-2.261; 4 3.251,-2.261; 5 0,-4.1
SOLDERJUMPER = smd 1.168 x 1.6: 1 -0.762,0; 2 0.762,0
SOT-223 = smd 1.27 x 2.286: 1 -2.286,-3.175; 2 0,-3.175; 3 2.286,-3.175 | smd 3.556 x 2.159: PAD 0,3.175
MICRO-SD-SOCKET-PP = smd 0.8 x 1.5: 1 -8.94,10.7; 2 -7.84,10.3; 3 -6.74,10.7; 4 -5.64,10.9; 5 -4.54,10.7; 6 -3.44,10.9; 7 -2.34,10.7; 8 -1.24,10.7 | smd 1.8 x 1.4: CD1 -7.75,0.4; CD2 -2.05,0.4 | smd 1.4 x 1.9: GND1 -13.6,14.55; GND2 -0.45,13.55
QFN32 = smd 0.305 x 0.813: 1 1.75,2.4; 2 1.25,2.4; 3 0.75,2.4; 4 0.25,2.4; 5 -0.25,2.4; 6 -0.75,2.4; 7 -1.25,2.4; 8 -1.75,2.4; 17 -1.75,-2.4; 18 -1.25,-2.4; 19 -0.75,-2.4; 20 -0.25,-2.4; 21 0.25,-2.4; 22 0.75,-2.4; 23 1.25,-2.4; 24 1.75,-2.4 | smd 0.813 x 0.305: 9 -2.4,1.75; 10 -2.4,1.25; 11 -2.4,0.75; 12 -2.4,0.25; 13 -2.4,-0.25; 14 -2.4,-0.75; 15 -2.4,-1.25; 16 -2.4,-1.75; 25 2.4,-1.75; 26 2.4,-1.25; 27 2.4,-0.75; 28 2.4,-0.25; 29 2.4,0.25; 30 2.4,0.75; 31 2.4,1.25; 32 2.4,1.75 | smd 3.607 x 3.607: HTAB 0,0
SOT-23' = smd 0.561 x 1.321: 1 -1.025,-0.945; 2 1.025,-0.945 | smd 0 x 0 bottom: 3 0,0.945
SOT23-5 = smd 0.55 x 1.2: 1 -0.95,-1.3; 2 0,-1.3; 3 0.95,-1.3; 4 0.95,1.3; 5 -0.95,1.3
RN41 = smd 0.8 x 1.6: 1 -6.6,-6.6; 2 -5.4,-6.6; 3 -4.2,-6.6; 4 -3,-6.6; 5 -1.8,-6.6; 6 -0.6,-6.6; 7 0.6,-6.6; 8 1.8,-6.6; 9 3,-6.6; 10 4.2,-6.6; 11 5.4,-6.6; 12 6.6,-6.6; 13 6.6,6.6; 14 5.4,6.6; 15 4.2,6.6; 16 3,6.6; 17 1.8,6.6; 18 0.6,6.6; 19 -0.6,6.6; 20 -1.8,6.6; 21 -3,6.6; 22 -4.2,6.6; 23 -5.4,6.6; 24 -6.6,6.6 | smd 1.6 x 0.8: 25 -9.4,4.8; 26 -9.4,3.2; 27 -9.4,1.6; 28 9.4,3.1; 29 9.4,-3.1; 30 9.4,-4.122; 31 9.4,-1.9; 32 9.4,-0.7; 33 9.4,0.7; 34 9.4,1.9; 35 9.4,4.122
MOUNTINGHOLE_2.5_PLATED = drill 2.5 pad 3.2: P$1 0,0

### Placement (x,y rotation side)
C1  14.38,56.21 90 top
C2  14.78,39.9 180 top
C3  15.52,44.15 90 top
C4  26.59,53.11 180 top
C5  18.44,19.13 90 top
C6  37.59,35.31 0 top
C7  37.59,30.73 180 top
C8  27.56,17.78 270 top
C9  36.58,41.91 90 top
C10  36.58,39.37 90 top
C11  30.86,19.56 90 top
C12  10.67,53.72 270 top
C13  10.95,30.94 90 top
C14  30.99,38.86 90 top
C15  10.9,51.87 270 top
C16  10.67,50.04 90 top
C17  21.84,17.53 270 top
C18  28.45,6.6 270 top
C19  30.99,36.83 90 top
C20  28.45,3.05 270 top
C21  14.22,54.48 90 top
C22  30.48,52.58 270 top
CN1  30.48,59.69 0 top
FID2  4.06,56.52 0 top
FID3  38.1,6.35 0 top
GND  27.94,14.48 0 top
J1  7.11,49.53 90 top
J2  7.11,31.75 270 top
J3  38.61,60.71 270 top
J4  40.13,46.99 270 top
J5  35.05,36.83 270 top
J6  14.73,36.83 270 top
J7  24.89,3.81 90 top
J8  12.83,61.47 270 top
JP1  4.57,49.53 90 top
JP2  9.65,29.21 270 top
K1  8.38,40.64 180 top
K2  24.89,25.65 0 top
LED1  16,42.42 90 top
LED2  19.69,62.36 90 top
LED3  19.69,60.71 270 top
LED4  19.69,59.05 270 top
LED5  19.69,57.4 270 top
Q1  31.12,41.66 180 top
R1  31.5,31.24 90 top
R2  10.77,47.68 270 top
R3  18.42,17.4 0 top
R4  11.68,33.27 90 top
R5  10.16,33.27 0 top
R6  11.18,56.13 0 top
R7  9.65,56.13 0 top
R8  19.81,33.27 180 top
R9  28.45,4.83 90 top
R10  16.31,39.9 180 top
R11  20.32,38.35 270 top
R12  20.32,39.88 270 top
R13  36.2,46.61 270 top
R14  23.88,60.2 90 top
R15  23.88,62.23 90 top
R16  31.12,44.45 270 top
R17  31.12,45.97 270 top
R18  36.2,43.81 270 top
R19  21.46,53.47 180 top
R20  2.54,49.02 180 top
R21  24.13,53.34 180 top
R22  36.2,45.21 270 top
S1  24.71,48.13 0 top
SJ1  23.24,42.16 0 top
SJ2  19.81,42.16 180 top
SJ3  18.29,54.86 0 top
T1  16.43,49.02 180 top
U1  31.37,35.31 180 bottom
U2  25.4,37.34 180 top
U3  AP7313-18SAG-7  [SOT-23']  19.81,35.81 0 top
U4  24.26,57.28 90 top
U5  24.38,46.99 270 bottom
U$1  46.74,53.09 0 top
U$15  3.05,53.09 180 top
U$17  40.01,13.84 0 top
U$18  9.78,13.84 0 top

### Tracks (layer width: path | path; a pad name or v marks a point on that pad's centre or on a via)
0/RX1  (2 unrouted)
1/TX1  (1 unrouted)
2  (1 unrouted)
3.3V  (24 unrouted)
3/PWM  (1 unrouted)
4/PWM  (1 unrouted)
5/PWM  (1 unrouted)
6/PWM  (1 unrouted)
7/SPI_MOSI  (via drill 0.4)  (1 unrouted)
  Top 0.203: K2.59 23.65,29.44 v23.88,29.21
  Bottom 0.203: U1.3 24.63,25.92 23.88,26.67 v23.88,29.21
9  (1 unrouted)
10/SPI_CS  (via drill 0.4)
  Top 0.203: R1.1 29.72,30.23 v29.46,30.23 28.65,31.04 K2.49
  Bottom 0.203: U1.2 23.53,26.51 23.17,26.88 23.17,29.5 23.89,30.23 v29.46,30.23
11  (1 unrouted)
12/SPI_MISO  (via drill 0.4)  (1 unrouted)
  Top 0.203: v28.45,29.52 27.15,30.81 K2.52
  Bottom 0.203: U1.7 29.03,28.94 v28.45,29.52
13/LED  (2 unrouted)
14/SPI_SCK  (via drill 0.4)  (1 unrouted)
  Top 0.203: K2.58 24.13,29.96 24.58,29.5 24.58,26.98 v24.89,26.67
  Bottom 0.203: v24.89,26.67 25.4,26.16 26.42,26.16 26.83,25.75 U1.5
15/A1  (1 unrouted)
16/A2  (1 unrouted)
17/A3  (1 unrouted)
18/A4/SDA  (3 unrouted)
19/A5/SCL  (3 unrouted)
20/A6/SPI_CS  (1 unrouted)
21/A7/SPI_CS  (1 unrouted)
22/A8  (1 unrouted)
23/A9  (1 unrouted)
24  (1 unrouted)
25/PWM  (1 unrouted)
26/A15  (1 unrouted)
27/A16  (1 unrouted)
28/A17  (1 unrouted)
30/A19  (1 unrouted)
A10  (1 unrouted)
A11  (1 unrouted)
AGND  (2 unrouted)
  pour Top (no thermals): 18.8,17.78 18.8,16.51 21.34,16.51 21.34,18.54 20.32,19.56 20.32,22.61 19.69,22.61 19.43,22.35 18.29,22.35 18.29,18.29
AREF  (3 unrouted)
D3  (1 unrouted)
D4  (1 unrouted)
D+  (1 unrouted)
D-  (1 unrouted)
GND  (60 unrouted)
  pour Top (no thermals): 22.35,15.49 23.37,16.51 32.51,16.51 33.53,15.49 33.53,13.46 32.51,12.45 23.37,12.45 22.35,13.46
HPGND  (3 unrouted)
HPL  (2 unrouted)
HPR  (2 unrouted)
ID  (2 unrouted)
LIL  (1 unrouted)
LIL_ISO  (1 unrouted)
LIR  (1 unrouted)
LIR_ISO  (1 unrouted)
LOL  (2 unrouted)
LOL_ISO  (1 unrouted)
LOR  (2 unrouted)
LOR_ISO  (1 unrouted)
MIC  (2 unrouted)
MIC_BIAS  (2 unrouted)
N$1  (3 unrouted)
N$2  (1 unrouted)
N$3  (1 unrouted)
N$4  (1 unrouted)
N$5  (1 unrouted)
  Top 0.406: GND.1 28.32,17.27 C8.1
N$6  (1 unrouted)
  Top 0.406: GND.2 30.35,19.3 C11.1
N$9  (1 unrouted)
N$10  (1 unrouted)
N$11  (1 unrouted)
N$12  (1 unrouted)
N$13  (1 unrouted)
N$14  (1 unrouted)
N$15  (3 unrouted)
N$18  (1 unrouted)
N$52  (1 unrouted)
N$68  (2 unrouted)
N$70  (1 unrouted)
N$71  (1 unrouted)
N$72  (2 unrouted)
N$73  (via drill 0.4)
  Top 0.203: v16.76,59.18 16.89,59.05 LED4.A
  Bottom 0.203: v16.76,59.18 16.76,57.66 16.26,57.15 16.26,50.55 16.76,50.04 17.74,50.04 U5.21
N$74  (via drill 0.4)
  Top 0.203: v16.06,58.17 16.82,57.4 LED5.A
  Bottom 0.203: U5.19 17.18,47.59 15.75,49.02 15.75,57.15 16.26,57.66 16.26,57.97 v16.06,58.17
N$75  (1 unrouted)
N$76  (1 unrouted)
N$79  (2 unrouted)
N$80  (1 unrouted)
PIO4  (via drill 0.4)
  Top 0.203: v19.3,50.55 v15.04,50.55 | R20.2 4.32,49.78 JP1.1
  Bottom 0.203: U5.22 18.66,51.19 v19.3,50.55 | v15.04,50.55 7.78,50.55 7.61,50.72 5.77,50.72 JP1.1
PROG  (3 unrouted)
RESET  (3 unrouted)
SMIRF_RX  (via drill 0.4)
  Top 0.203: v28.45,43.39 29.51,44.45 R16.2
  Bottom 0.203: U5.13 25.45,40.39 v28.45,43.39
SMIRF_TX  (via drill 0.4)
  Top 0.203: R17.2 29.97,45.97 v28.45,44.45 28.45,44.39 27.74,43.68 27.74,43.1 28.16,42.68 30.14,42.68 Q1.2
  Bottom 0.203: U5.14 25.59,41.59 v28.45,44.45
V_USB  (6 unrouted)
VIN  (7 unrouted)
VRTC  (1 unrouted)
(copper drawn outside any net)
  shapes: Top area x1